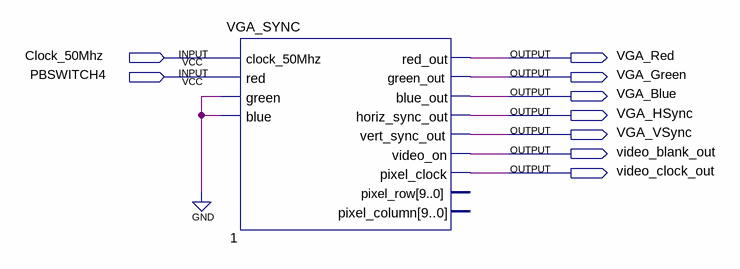
[diagram p0: schematic sheet]
// Quartus schematic VGA_LED.bdf as structural Verilog: 1 symbols, 9 pins
module VGA_LED (
  input  Clock_50Mhz,
  input  PBSWITCH4,
  output VGA_Red,
  output VGA_Green,
  output VGA_Blue,
  output VGA_HSync,
  output VGA_VSync,
  output video_blank_out,
  output video_clock_out
);

  VGA_SYNC u_1 (
    .red(PBSWITCH4), .green(1'b0), .blue(1'b0), .clock_50Mhz(Clock_50Mhz), .red_out(VGA_Red),
    .green_out(VGA_Green), .blue_out(VGA_Blue), .horiz_sync_out(VGA_HSync), .vert_sync_out(VGA_VSync),
    .video_on(video_blank_out), .pixel_clock(video_clock_out));  // open: pixel_row, pixel_column
endmodule
